# Altium schematic sheet I2C_Switch.SchDoc: I2C switch
size 420 x 297 mm; CheckedBy: G.Kasprowicz; Author: INR Moscow; CompanyName: WUT ISE; DrawnBy: G.Kasprowicz; Organization: WUT ISE; Address1: PW ISE; Address2: Nowowiejska 15/19 00-665 Warsaw; Address3: gkasprow@gmail.com; DocumentNumber: 10; Revision: 2; SheetNumber: 35; SheetTotal: 35; ModifiedBy: -; CheckedDate: -; DivGrp: WUT ISE; Designer: GK; ModifiedDate: -; ProjectName: Sensor Box
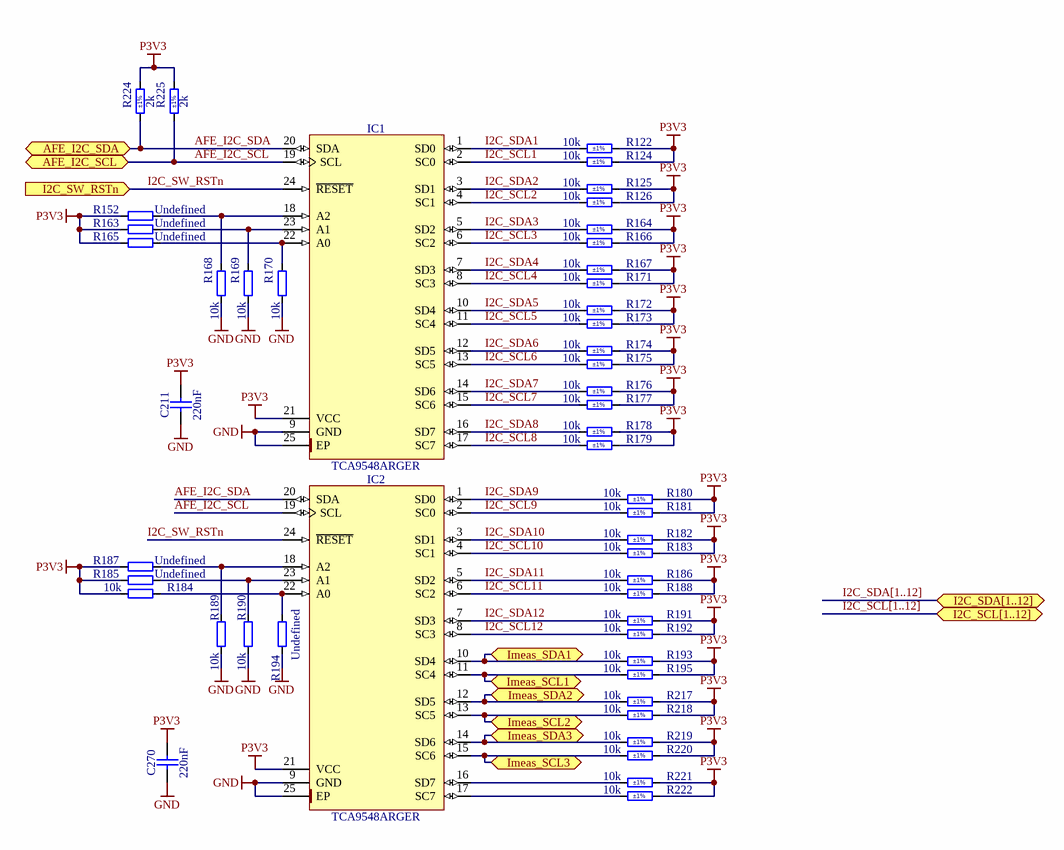
[diagram p0: I2C_Switch.SchDoc]

## Parts
C211  220nF  [CAPC1005X55N]
C270  220nF  [CAPC1005X55N]
IC1  TCA9548ARGER  [QFN50P400X400X100-25N-S220]
IC2  TCA9548ARGER  [QFN50P400X400X100-25N-S220]
R122  10k  Tolerance: ±1%  [RESC2012X60N]
R124  10k  Tolerance: ±1%  [RESC2012X60N]
R125  10k  Tolerance: ±1%  [RESC2012X60N]
R126  10k  Tolerance: ±1%  [RESC2012X60N]
R152  Undefined  [RESC1608X55N]
R163  Undefined  [RESC1608X55N]
R164  10k  Tolerance: ±1%  [RESC2012X60N]
R165  Undefined  [RESC1608X55N]
R166  10k  Tolerance: ±1%  [RESC2012X60N]
R167  10k  Tolerance: ±1%  [RESC2012X60N]
R168  10k  [RESC2012X60N]
R169  10k  [RESC2012X60N]
R170  10k  [RESC2012X60N]
R171  10k  Tolerance: ±1%  [RESC2012X60N]
R172  10k  Tolerance: ±1%  [RESC2012X60N]
R173  10k  Tolerance: ±1%  [RESC2012X60N]
R174  10k  Tolerance: ±1%  [RESC2012X60N]
R175  10k  Tolerance: ±1%  [RESC2012X60N]
R176  10k  Tolerance: ±1%  [RESC2012X60N]
R177  10k  Tolerance: ±1%  [RESC2012X60N]
R178  10k  Tolerance: ±1%  [RESC2012X60N]
R179  10k  Tolerance: ±1%  [RESC2012X60N]
R180  10k  Tolerance: ±1%  [RESC2012X60N]
R181  10k  Tolerance: ±1%  [RESC2012X60N]
R182  10k  Tolerance: ±1%  [RESC2012X60N]
R183  10k  Tolerance: ±1%  [RESC2012X60N]
R184  10k  [RESC2012X60N]
R185  Undefined  [RESC1608X55N]
R186  10k  Tolerance: ±1%  [RESC2012X60N]
R187  Undefined  [RESC1608X55N]
R188  10k  Tolerance: ±1%  [RESC2012X60N]
R189  10k  [RESC2012X60N]
R190  10k  [RESC2012X60N]
R191  10k  Tolerance: ±1%  [RESC2012X60N]
R192  10k  Tolerance: ±1%  [RESC2012X60N]
R193  10k  Tolerance: ±1%  [RESC2012X60N]
R194  Undefined  [RESC1608X55N]
R195  10k  Tolerance: ±1%  [RESC2012X60N]
R217  10k  Tolerance: ±1%  [RESC2012X60N]
R218  10k  Tolerance: ±1%  [RESC2012X60N]
R219  10k  Tolerance: ±1%  [RESC2012X60N]
R220  10k  Tolerance: ±1%  [RESC2012X60N]
R221  10k  Tolerance: ±1%  [RESC2012X60N]
R222  10k  Tolerance: ±1%  [RESC2012X60N]
R224  2k  Tolerance: ±1%  [RESC2012X60N]
R225  2k  Tolerance: ±1%  [RESC2012X60N]

## Ports
AFE_I2C_SCL (bidir), AFE_I2C_SDA (bidir), I2C_SCL[1..12] (bidir), I2C_SDA[1..12] (bidir), I2C_SW_RSTn (in), Imeas_SCL1 (bidir), Imeas_SCL2 (bidir), Imeas_SCL3 (bidir), Imeas_SDA1 (bidir), Imeas_SDA2 (bidir), Imeas_SDA3 (bidir)

## Nets
GND: C211.1 C270.1 IC1.9(GND) IC1.25(EP) IC2.9(GND) IC2.25(EP) R168.2 R169.2 R170.2 R189.2 R190.2 R194.1
P3V3: C211.2 C270.2 IC1.21(VCC) IC2.21(VCC) R122.1 R124.1 R125.1 R126.1 R152.1 R163.1 R164.1 R165.1 R166.1 R167.1 R171.1 R172.1 R173.1 R174.1 R175.1 R176.1 R177.1 R178.1 R179.1 R180.1 R181.1 R182.1 R183.1 R184.2 R185.1 R186.1 R187.1 R188.1 R191.1 R192.1 R193.1 R195.1 R217.1 R218.1 R219.1 R220.1 R221.1 R222.1 R224.2 R225.2
AFE_I2C_SCL: IC1.19(SCL) IC2.19(SCL) R225.1 ; port AFE_I2C_SCL
AFE_I2C_SDA: IC1.20(SDA) IC2.20(SDA) R224.1 ; port AFE_I2C_SDA
I2C_SCL1: IC1.2(SC0) R124.2
I2C_SCL2: IC1.4(SC1) R126.2
I2C_SCL3: IC1.6(SC2) R166.2
I2C_SCL4: IC1.8(SC3) R171.2
I2C_SCL5: IC1.11(SC4) R173.2
I2C_SCL6: IC1.13(SC5) R175.2
I2C_SCL7: IC1.15(SC6) R177.2
I2C_SCL8: IC1.17(SC7) R179.2
I2C_SCL9: IC2.2(SC0) R181.2
I2C_SCL10: IC2.4(SC1) R183.2
I2C_SCL11: IC2.6(SC2) R188.2
I2C_SCL12: IC2.8(SC3) R192.2
I2C_SDA1: IC1.1(SD0) R122.2
I2C_SDA2: IC1.3(SD1) R125.2
I2C_SDA3: IC1.5(SD2) R164.2
I2C_SDA4: IC1.7(SD3) R167.2
I2C_SDA5: IC1.10(SD4) R172.2
I2C_SDA6: IC1.12(SD5) R174.2
I2C_SDA7: IC1.14(SD6) R176.2
I2C_SDA8: IC1.16(SD7) R178.2
I2C_SDA9: IC2.1(SD0) R180.2
I2C_SDA10: IC2.3(SD1) R182.2
I2C_SDA11: IC2.5(SD2) R186.2
I2C_SDA12: IC2.7(SD3) R191.2
I2C_SW_RSTn: IC1.24(~{RESET}) IC2.24(~{RESET}) ; port I2C_SW_RSTn
Imeas_SCL1: IC2.11(SC4) R195.2 ; port Imeas_SCL1
Imeas_SCL2: IC2.13(SC5) R218.2 ; port Imeas_SCL2
Imeas_SCL3: IC2.15(SC6) R220.2 ; port Imeas_SCL3
Imeas_SDA1: IC2.10(SD4) R193.2 ; port Imeas_SDA1
Imeas_SDA2: IC2.12(SD5) R217.2 ; port Imeas_SDA2
Imeas_SDA3: IC2.14(SD6) R219.2 ; port Imeas_SDA3
NetIC1_18: IC1.18(A2) R152.2 R168.1
NetIC1_22: IC1.22(A0) R165.2 R170.1
NetIC1_23: IC1.23(A1) R163.2 R169.1
NetIC2_16: IC2.16(SD7) R221.2
NetIC2_17: IC2.17(SC7) R222.2
NetIC2_18: IC2.18(A2) R187.2 R189.1
NetIC2_22: IC2.22(A0) R184.1 R194.2
NetIC2_23: IC2.23(A1) R185.2 R190.1

## Buses and harness runs
bus I2C_SCL[1..12] = port I2C_SCL[1..12]
bus I2C_SDA[1..12] = port I2C_SDA[1..12]

## Notes on the sheet
- Project/Equipment
- Document
- Designer
- Drawn by
- Check.by
- Copyright WUT ISE 2024.
  This documentation describes Open Hardware and is licensed under the CERN OHL v.2. You may redistribute and modify this documentation under the terms of the CERN OHL v.2. (http://ohwr.org/CERNOHL). This documentation is distributed WITHOUT ANY EXPRESS OR IMPLIED WARRANTY, INCLUDING OF MERCHANTABILITY, SATISFACTORY QUALITY AND FITNESS FOR A PARTICULAR PURPOSE. Please see the CERN OHL v.2 for applicable conditions.
- Contact
- File
- Last Mod.
- Print Date
- Sheet
- Size
- A3
- of
- Rev

## Library data of the parts
C211 C270 = CC0402_220NF_35V_10%_X7R: Non-polarised capacitor; Part Description: SMD Multilayer Chip Ceramic Capacitor; Manufacturer: GENERIC; Manufacturer1 Part Number: CGA2B1X7R1V224K050; Voltage: 35V; TC: X7R; Tolerance: ±10%; Part Number: CC0402_220NF_35V_10%_X7R; Component Kind: Standard; Component Type: Standard; Pin Count: 2; Value: 220nF; Status: None; Manufacturer Part Number: CC0402_220NF_35V_10%_X7R; Case: 0402; Mounted: Yes; Socket: No; SMD: Yes; Sense: No; Manufacturer1 Example: TDK; Manufacturer1 ComponentHeight: 0.55mm; HelpURL: \\cern.ch\dfs\Applications\Altium\Datasheets\CC0402_X7R_TDK_CGA.pdf; Author: CERN DEM HF; CreateDate: 09.11.2023; LatestRevisionDate: 09.11.2023
IC1 IC2 = TCA9548ARGER: Low Voltage 8-Channel I2C Switch With Reset; Manufacturer: TEXAS INSTRUMENTS; PressFit: No; Bonding: No; Part Number: TCA9548ARGER; Component Kind: Standard; Component Type: Standard; Device: TCA9548ARGER; PackageDescription: QFN, 0.50mm Pitch, Square; 24 Pin, 4.00mm L X 4.00mm W X 1.00mm H body (w/Thermal Tab 2.20 X 2.20mm), IPC Medium Density; Part Description: Low Voltage 8-Channel I2C Switch with Reset; Manufacturer Part Number: TCA9548ARGE; Pin Count: 25; Case: QFN24; Mounted: Yes; Socket: No; SMD: Yes; Sense: No; ComponentHeight: 1mm; Author: CERN DEM JLC; HelpURL: \\cern.ch\dfs\Applications\Altium\Datasheets\TCA9548ARGER.pdf; CreateDate: 07.07.2014; LatestRevisionDate: 13.06.2022
R122 R124-R126 R164 R166-R184 R186 R188-R193 R195 R217-R222 = R0805_10K_1%_0.125W_100PPM: Resistor - 1%; Part Description: General Purpose Thick Film Chip Resistor; Manufacturer: GENERIC; Manufacturer1 Part Number: NRC10F1002TRF; Power: 0.125W; TC: ±100ppm/°C; PressFit: No; Part Number: R0805_10K_1%_0.125W_100PPM; Component Kind: Standard; Component Type: Standard; Pin Count: 2; Value: 10k; Status: Preferred; Manufacturer Part Number: R0805_10K_1%_0.125W_100PPM; Case: 0805; Mounted: Yes; Sense: No; Socket: No; SMD: Yes; Manufacturer1 Example: NIC COMPONENT; Manufacturer1 ComponentHeight: 0.6mm; HelpURL: \\cern.ch\dfs\Applications\Altium\Datasheets\R0805_NIC_NRC.pdf; Author: CERN DEM JLC; CreateDate: 03.12.2007; LatestRevisionDate: 13.03.2008
R152 R163 R165 R185 R187 R194 = R0603_NO-VALUE: Resistor; Part Description: Reserved Footprint For a 0603 (1608) Chip Resistor; PressFit: No; Mounted: No; Part Number: R0603_NO-VALUE; Component Kind: Standard; Component Type: Standard; Pin Count: 2; Value: Undefined; Status: None; Manufacturer: Undefined; Manufacturer Part Number: R0603_NO-VALUE; Case: 0603; Sense: No; Socket: No; SMD: Yes; Manufacturer1 Example: Undefined; Manufacturer1 Part Number: Undefined; Manufacturer1 ComponentHeight: Undefined; HelpURL: Undefined; Author: CERN DEM JLC; CreateDate: 03.12.2007; LatestRevisionDate: 13.03.2008
R224 R225 = R0805_2K_1%_0.125W_100PPM: Resistor - 1%; Part Description: General Purpose Thick Film Chip Resistor; Manufacturer: GENERIC; Manufacturer1 Part Number: NRC10F2001TRF; Power: 0.125W; TC: ±100ppm/°C; PressFit: No; Part Number: R0805_2K_1%_0.125W_100PPM; Component Kind: Standard; Component Type: Standard; Pin Count: 2; Value: 2k; Status: Preferred; Manufacturer Part Number: R0805_2K_1%_0.125W_100PPM; Case: 0805; Mounted: Yes; Sense: No; Socket: No; SMD: Yes; Manufacturer1 Example: NIC COMPONENT; Manufacturer1 ComponentHeight: 0.6mm; HelpURL: \\cern.ch\dfs\Applications\Altium\Datasheets\R0805_NIC_NRC.pdf; Author: CERN DEM JLC; CreateDate: 03.12.2007; LatestRevisionDate: 13.03.2008